# EAGLE design mac-agave (EAGLE 5.11)
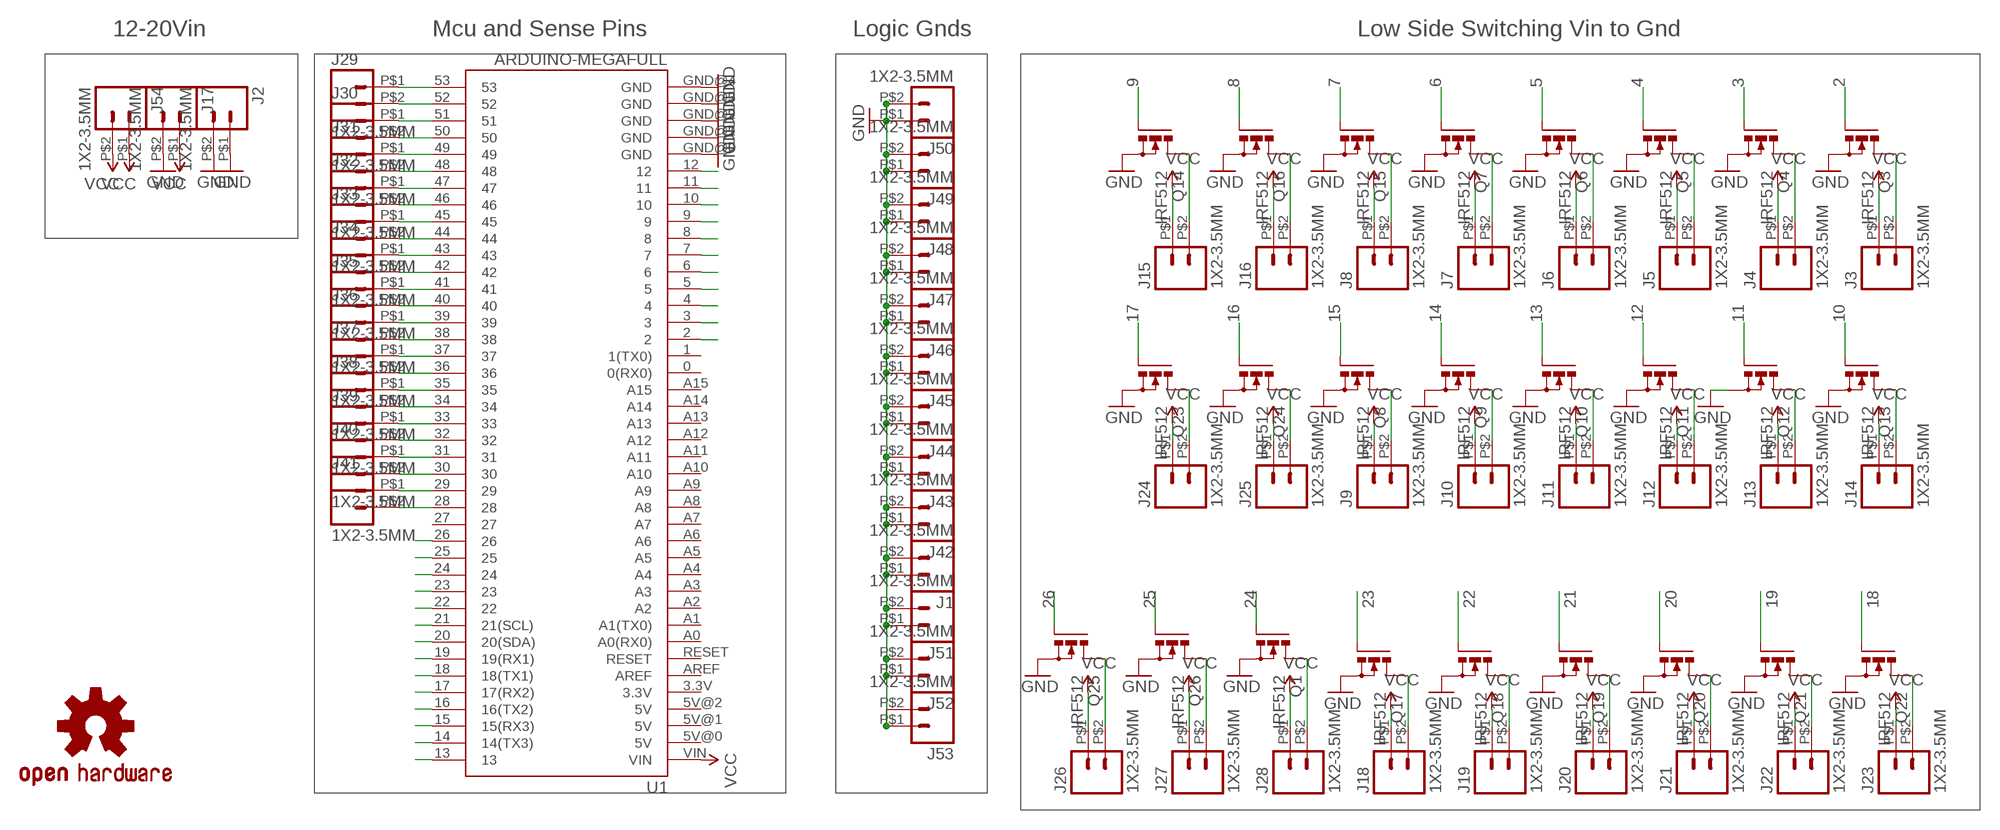
[diagram p0: schematic, sheet 1]

## Parts
J1  1X2-3.5MM  M02  [SCREWTERMINAL-2.54MM-2-NS]
J2  1X2-3.5MM  M02  [SCREWTERMINAL-2.54MM-2-NS]
J3  1X2-3.5MM  M02  [SCREWTERMINAL-2.54MM-2-NS]
J4  1X2-3.5MM  M02  [SCREWTERMINAL-2.54MM-2-NS]
J5  1X2-3.5MM  M02  [SCREWTERMINAL-2.54MM-2-NS]
J6  1X2-3.5MM  M02  [SCREWTERMINAL-2.54MM-2-NS]
J7  1X2-3.5MM  M02  [SCREWTERMINAL-2.54MM-2-NS]
J8  1X2-3.5MM  M02  [SCREWTERMINAL-2.54MM-2-NS]
J9  1X2-3.5MM  M02  [SCREWTERMINAL-2.54MM-2-NS]
J10  1X2-3.5MM  M02  [SCREWTERMINAL-2.54MM-2-NS]
J11  1X2-3.5MM  M02  [SCREWTERMINAL-2.54MM-2-NS]
J12  1X2-3.5MM  M02  [SCREWTERMINAL-2.54MM-2-NS]
J13  1X2-3.5MM  M02  [SCREWTERMINAL-2.54MM-2-NS]
J14  1X2-3.5MM  M02  [SCREWTERMINAL-2.54MM-2-NS]
J15  1X2-3.5MM  M02  [SCREWTERMINAL-2.54MM-2-NS]
J16  1X2-3.5MM  M02  [SCREWTERMINAL-2.54MM-2-NS]
J17  1X2-3.5MM  M02  [SCREWTERMINAL-2.54MM-2-NS]
J18  1X2-3.5MM  M02  [SCREWTERMINAL-2.54MM-2-NS]
J19  1X2-3.5MM  M02  [SCREWTERMINAL-2.54MM-2-NS]
J20  1X2-3.5MM  M02  [SCREWTERMINAL-2.54MM-2-NS]
J21  1X2-3.5MM  M02  [SCREWTERMINAL-2.54MM-2-NS]
J22  1X2-3.5MM  M02  [SCREWTERMINAL-2.54MM-2-NS]
J23  1X2-3.5MM  M02  [SCREWTERMINAL-2.54MM-2-NS]
J24  1X2-3.5MM  M02  [SCREWTERMINAL-2.54MM-2-NS]
J25  1X2-3.5MM  M02  [SCREWTERMINAL-2.54MM-2-NS]
J26  1X2-3.5MM  M02  [SCREWTERMINAL-2.54MM-2-NS]
J27  1X2-3.5MM  M02  [SCREWTERMINAL-2.54MM-2-NS]
J28  1X2-3.5MM  M02  [SCREWTERMINAL-2.54MM-2-NS]
J29  1X2-3.5MM  M02  [SCREWTERMINAL-2.54MM-2-NS]
J30  1X2-3.5MM  M02  [SCREWTERMINAL-2.54MM-2-NS]
J31  1X2-3.5MM  M02  [SCREWTERMINAL-2.54MM-2-NS]
J32  1X2-3.5MM  M02  [SCREWTERMINAL-2.54MM-2-NS]
J33  1X2-3.5MM  M02  [SCREWTERMINAL-2.54MM-2-NS]
J34  1X2-3.5MM  M02  [SCREWTERMINAL-2.54MM-2-NS]
J35  1X2-3.5MM  M02  [SCREWTERMINAL-2.54MM-2-NS]
J36  1X2-3.5MM  M02  [SCREWTERMINAL-2.54MM-2-NS]
J37  1X2-3.5MM  M02  [SCREWTERMINAL-2.54MM-2-NS]
J38  1X2-3.5MM  M02  [SCREWTERMINAL-2.54MM-2-NS]
J39  1X2-3.5MM  M02  [SCREWTERMINAL-2.54MM-2-NS]
J40  1X2-3.5MM  M02  [SCREWTERMINAL-2.54MM-2-NS]
J41  1X2-3.5MM  M02  [SCREWTERMINAL-2.54MM-2-NS]
J42  1X2-3.5MM  M02  [SCREWTERMINAL-2.54MM-2-NS]
J43  1X2-3.5MM  M02  [SCREWTERMINAL-2.54MM-2-NS]
J44  1X2-3.5MM  M02  [SCREWTERMINAL-2.54MM-2-NS]
J45  1X2-3.5MM  M02  [SCREWTERMINAL-2.54MM-2-NS]
J46  1X2-3.5MM  M02  [SCREWTERMINAL-2.54MM-2-NS]
J47  1X2-3.5MM  M02  [SCREWTERMINAL-2.54MM-2-NS]
J48  1X2-3.5MM  M02  [SCREWTERMINAL-2.54MM-2-NS]
J49  1X2-3.5MM  M02  [SCREWTERMINAL-2.54MM-2-NS]
J50  1X2-3.5MM  M02  [SCREWTERMINAL-2.54MM-2-NS]
J51  1X2-3.5MM  M02  [SCREWTERMINAL-2.54MM-2-NS]
J52  1X2-3.5MM  M02  [SCREWTERMINAL-2.54MM-2-NS]
J53  1X2-3.5MM  M02  [SCREWTERMINAL-2.54MM-2-NS]
J54  1X2-3.5MM  M02  [SCREWTERMINAL-2.54MM-2-NS]
Q1  IRF512  [TO220BV]
Q3  IRF512  [TO220BV]
Q4  IRF512  [TO220BV]
Q5  IRF512  [TO220BV]
Q6  IRF512  [TO220BV]
Q7  IRF512  [TO220BV]
Q8  IRF512  [TO220BV]
Q9  IRF512  [TO220BV]
Q10  IRF512  [TO220BV]
Q11  IRF512  [TO220BV]
Q12  IRF512  [TO220BV]
Q13  IRF512  [TO220BV]
Q14  IRF512  [TO220BV]
Q15  IRF512  [TO220BV]
Q16  IRF512  [TO220BV]
Q17  IRF512  [TO220BV]
Q18  IRF512  [TO220BV]
Q19  IRF512  [TO220BV]
Q20  IRF512  [TO220BV]
Q21  IRF512  [TO220BV]
Q22  IRF512  [TO220BV]
Q23  IRF512  [TO220BV]
Q24  IRF512  [TO220BV]
Q25  IRF512  [TO220BV]
Q26  IRF512  [TO220BV]
U1  ARDUINO-MEGAFULL  [ARDUINO_MEGA]
U$1  OSHW-LOGOM  [OSHW-LOGO-M]

## Nets
2: Q3.G U1.2
3: Q4.G U1.3
4: Q5.G U1.4
5: Q6.G U1.5
6: Q7.G U1.6
7: Q15.G U1.7
8: Q16.G U1.8
9: Q14.G U1.9
10: Q13.G U1.10
11: Q12.G U1.11
12: Q11.G U1.12
13: Q10.G U1.13
14: Q9.G U1.14(14(TX3))
15: Q8.G U1.15(15(RX3))
16: Q24.G U1.16(16(TX2))
17: Q23.G U1.17(17(RX2))
18: Q22.G U1.18(18(TX1))
19: Q21.G U1.19(19(RX1))
20: Q20.G U1.20(20(SDA))
21: Q19.G U1.21(21(SCL))
22: Q18.G U1.22
23: Q17.G U1.23
24: Q1.G U1.24
25: Q26.G U1.25
26: Q25.G U1.26
28: J41.P$2 U1.28
29: J41.P$1 U1.29
30: J40.P$2 U1.30
31: J40.P$1 U1.31
32: J39.P$2 U1.32
33: J39.P$1 U1.33
34: J38.P$2 U1.34
35: J38.P$1 U1.35
36: J37.P$2 U1.36
37: J37.P$1 U1.37
38: J36.P$2 U1.38
39: J36.P$1 U1.39
40: J35.P$2 U1.40
41: J35.P$1 U1.41
42: J34.P$2 U1.42
43: J34.P$1 U1.43
44: J33.P$2 U1.44
45: J33.P$1 U1.45
46: J32.P$2 U1.46
47: J32.P$1 U1.47
48: J31.P$2 U1.48
49: J31.P$1 U1.49
50: J30.P$2 U1.50
51: J30.P$1 U1.51
52: J29.P$2 U1.52
53: J29.P$1 U1.53
GND: J1.P$1 J1.P$2 J2.P$1 J2.P$2 J17.P$2 J42.P$1 J42.P$2 J43.P$1 J43.P$2 J44.P$1 J44.P$2 J45.P$1 J45.P$2 J46.P$1 J46.P$2 J47.P$1 J47.P$2 J48.P$1 J48.P$2 J49.P$1 J49.P$2 J50.P$1 J50.P$2 J51.P$1 J51.P$2 J52.P$1 J52.P$2 J53.P$1 J53.P$2 Q1.S Q3.S Q4.S Q5.S Q6.S Q7.S Q8.S Q9.S Q10.S Q11.S Q12.S Q13.S Q14.S Q15.S Q16.S Q17.S Q18.S Q19.S Q20.S Q21.S Q22.S Q23.S Q24.S Q25.S Q26.S U1.GND@0(GND) U1.GND@1(GND) U1.GND@2(GND) U1.GND@3(GND) U1.GND@4(GND)
N$1 [power]: J9.P$2 Q8.D
N$2 [power]: J10.P$2 Q9.D
N$4 [power]: J11.P$2 Q10.D
N$5 [power]: J3.P$2 Q3.D
N$6 [power]: J18.P$2 Q17.D
N$7 [power]: J4.P$2 Q4.D
N$8 [power]: J19.P$2 Q18.D
N$9 [power]: J5.P$2 Q5.D
N$10 [power]: J12.P$2 Q11.D
N$11 [power]: J13.P$2 Q12.D
N$12 [power]: J14.P$2 Q13.D
N$13 [power]: J15.P$2 Q14.D
N$14 [power]: J16.P$2 Q16.D
N$21 [power]: J6.P$2 Q6.D
N$23 [power]: J7.P$2 Q7.D
N$25 [power]: J8.P$2 Q15.D
N$35 [power]: J20.P$2 Q19.D
N$36 [power]: J21.P$2 Q20.D
N$37 [power]: J22.P$2 Q21.D
N$38 [power]: J23.P$2 Q22.D
N$39 [power]: J24.P$2 Q23.D
N$40 [power]: J25.P$2 Q24.D
N$49 [power]: J26.P$2 Q25.D
N$50 [power]: J27.P$2 Q26.D
N$51 [power]: J28.P$2 Q1.D
VCC [power]: J3.P$1 J4.P$1 J5.P$1 J6.P$1 J7.P$1 J8.P$1 J9.P$1 J10.P$1 J11.P$1 J12.P$1 J13.P$1 J14.P$1 J15.P$1 J16.P$1 J17.P$1 J18.P$1 J19.P$1 J20.P$1 J21.P$1 J22.P$1 J23.P$1 J24.P$1 J25.P$1 J26.P$1 J27.P$1 J28.P$1 J54.P$1 J54.P$2 U1.VIN
Unconnected: U1.0(0(RX0)) U1.1(1(TX0)) U1.3.3V U1.5V@0(5V) U1.5V@1(5V) U1.5V@2(5V) U1.27 U1.A0(A0(RX0)) U1.A1(A1(TX0)) U1.A2 U1.A3 U1.A4 U1.A5 U1.A6 U1.A7 U1.A8 U1.A9 U1.A10 U1.A11 U1.A12 U1.A13 U1.A14 U1.A15 U1.AREF U1.RESET

## Notes on the sheet
- 12-20Vin | Mcu and Sense Pins | Logic Gnds | Low Side Switching Vin to Gnd

## Library data of the parts
J1-J54 = SparkFun:M02: Header 2 Standard 2-pin 0.1" header. Use with straight break away headers (SKU : PRT-00116), right angle break away headers (PRT-00553), swiss pins (PRT-00743), machine pins (PRT-00117), and female headers (PRT-00115). Molex polarized connector foot print use with SKU : PRT-08233 with associated crimp pins and housings.
Q1 Q3-Q26 = transistor-power:IRF512: N-CHANNEL MOS FET
U1 = SparkFun:ARDUINO-MEGA: Arduino Mega footprint connections
U$1 = SparkFun:OSHW-LOGO: Open Source Hardware Logo This logo indicates the piece of hardware it is found on incorporates a OSHW license and/or adheres to the definition of open source hardware found here: http://freedomdefined.org/OSHW

## Net classes
1 power: width 1.905 mm

## Board
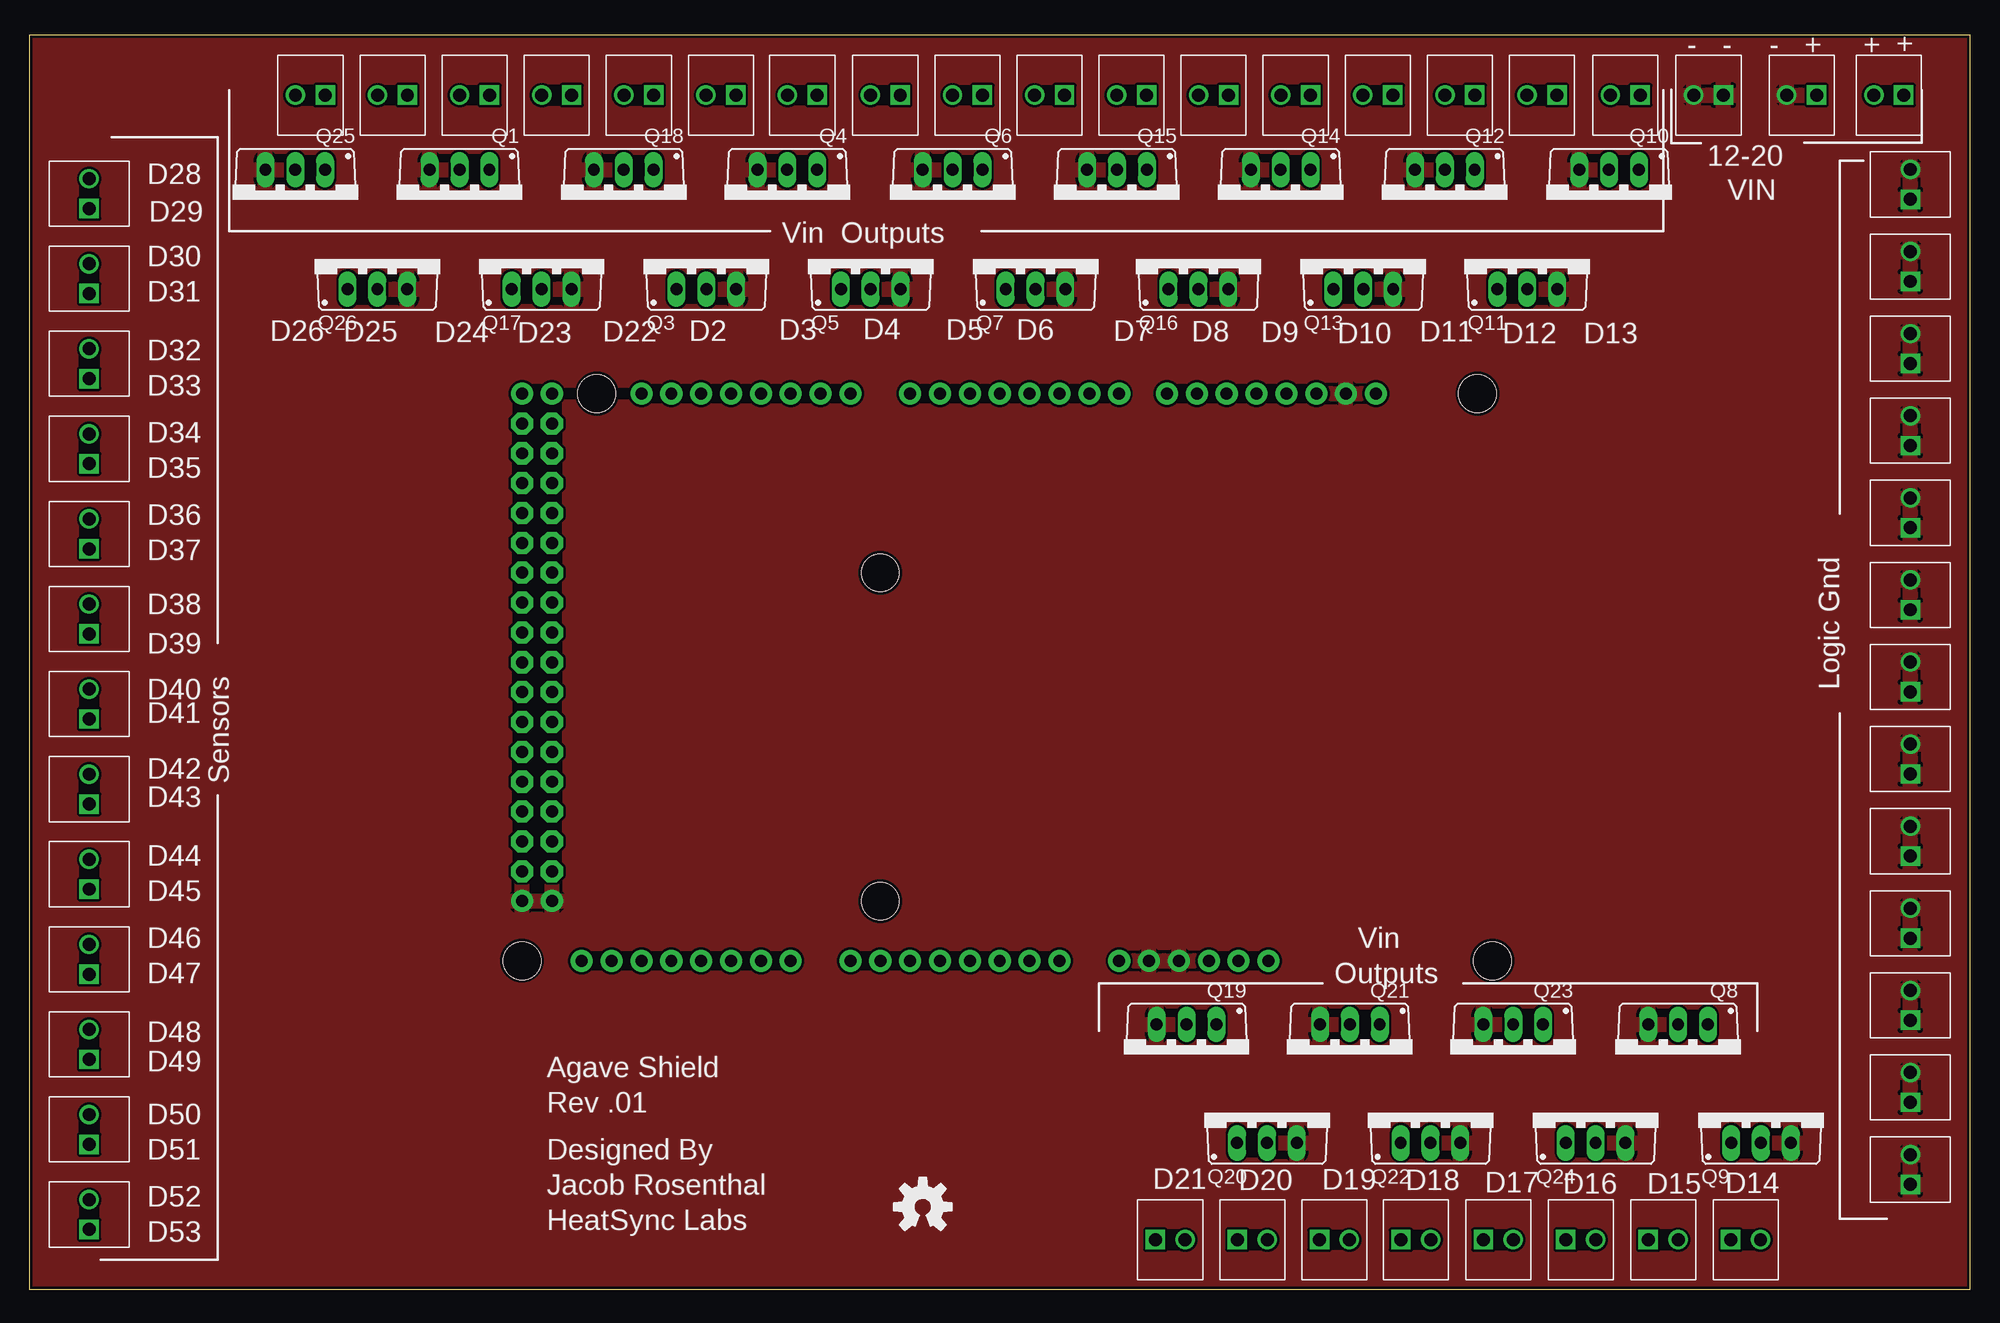
[diagram p1: board, top side]
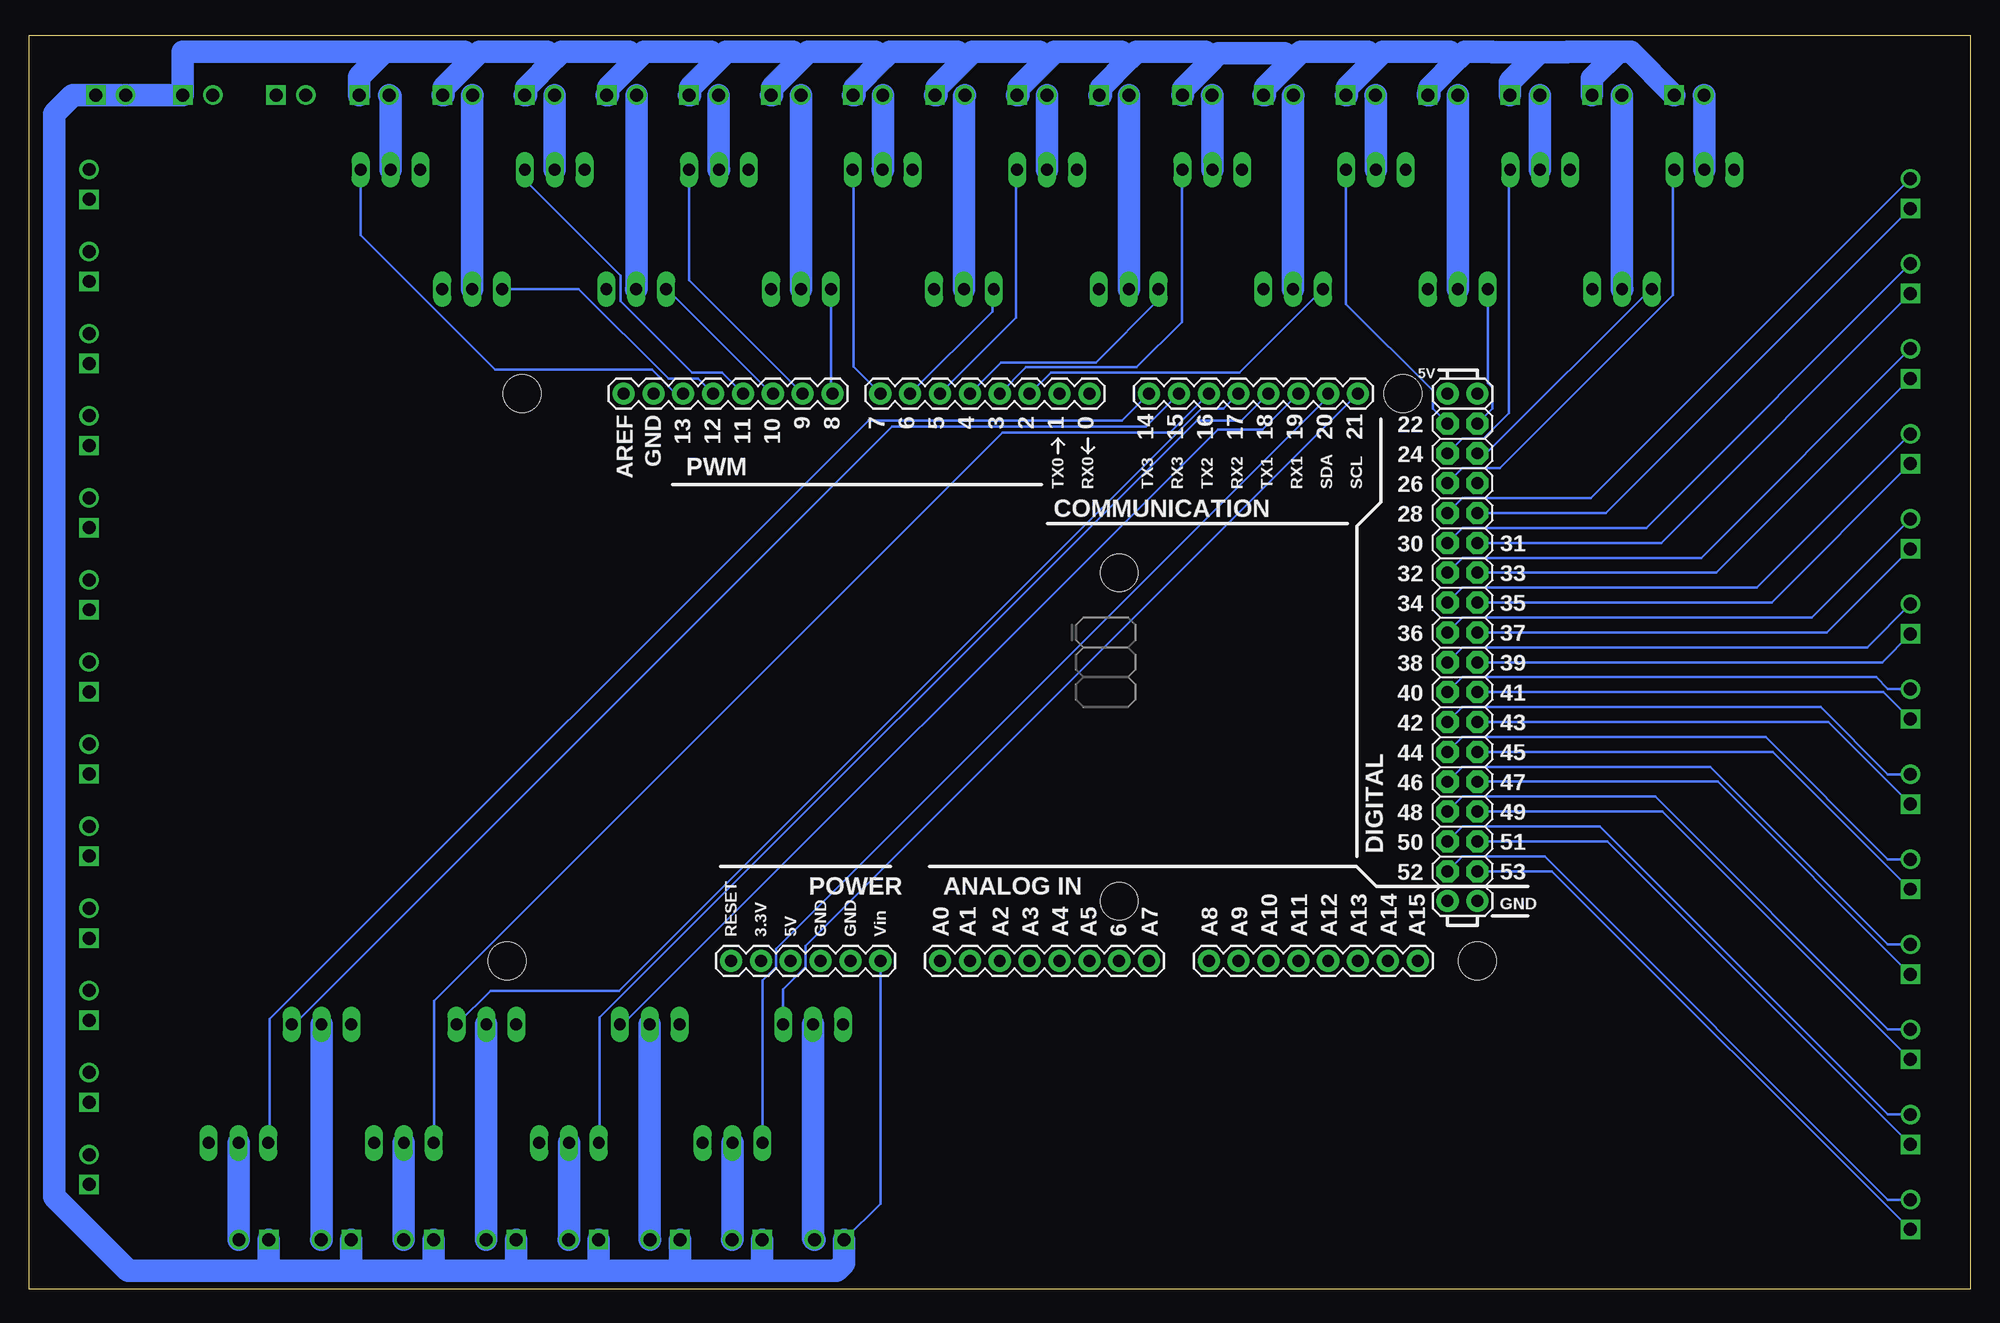
[diagram p2: board, bottom side, seen from below]

Size 165.1 x 106.68 mm. Coordinates in mm from the lower left corner, seen from the top.
Outline: 0,0 165.1,0 165.1,106.68 0,106.68 0,0
Copper layers (1*16): Top 0.035mm / dielectric 1.5mm / Bottom 0.035mm
Design rules "Fusion_eagle_rule_v1.1 *": minimum track width 8mil, minimum drill 12mil, track to track 8mil, track to pad 8mil, pad to pad 8mil, via to via 8mil, smd to smd 0mil, copper to edge 10mil, drill to drill 10mil, minimum pad ring 10mil, minimum via ring 6mil, stop-mask expansion 2mil, vias tented up to drill 100mil, thermal gap 10mil

### Footprints (pad centres in the part's own frame; a part is rotated, then mirrored left to right if it is on the bottom)
SCREWTERMINAL-2.54MM-2-NS = drill 1.1 square: P$1 0,0 | drill 1.1 round: P$2 2.54,0
TO220BV = drill 1.016 long: D 0,-2.54; G -2.54,-2.54; S 2.54,-2.54
ARDUINO_MEGA = drill 1.016 pad 1.88 round: 0 63.5,50.8; 1 60.96,50.8; 2 58.42,50.8; 3 55.88,50.8; 3.3V 35.56,2.54; 4 53.34,50.8; 5 50.8,50.8; 5V@0 38.1,2.54; 5V@1 93.98,50.8; 5V@2 96.52,50.8; 6 48.26,50.8; 7 45.72,50.8; 8 41.656,50.8; 9 39.116,50.8; 10 36.576,50.8; 11 34.036,50.8; 12 31.496,50.8; 13 28.956,50.8; 14 68.58,50.8; 15 71.12,50.8; 16 73.66,50.8; 17 76.2,50.8; 18 78.74,50.8; 19 81.28,50.8; 20 83.82,50.8; 21 86.36,50.8; A0 50.8,2.54; A1 53.34,2.54; A2 55.88,2.54; A3 58.42,2.54; A4 60.96,2.54; A5 63.5,2.54; A6 66.04,2.54; A7 68.58,2.54; A8 73.66,2.54; A9 76.2,2.54; A10 78.74,2.54; A11 81.28,2.54; A12 83.82,2.54; A13 86.36,2.54; A14 88.9,2.54; A15 91.44,2.54; AREF 23.876,50.8; GND@0 40.64,2.54; GND@1 43.18,2.54; GND@2 93.98,7.62; GND@3 96.52,7.62; GND@4 26.416,50.8; RESET 33.02,2.54; VIN 45.72,2.54 | drill 1.016 pad 1.88 octagon: 22 93.98,48.26; 23 96.52,48.26; 24 93.98,45.72; 25 96.52,45.72; 26 93.98,43.18; 27 96.52,43.18; 28 93.98,40.64; 29 96.52,40.64; 30 93.98,38.1; 31 96.52,38.1; 32 93.98,35.56; 33 96.52,35.56; 34 93.98,33.02; 35 96.52,33.02; 36 93.98,30.48; 37 96.52,30.48; 38 93.98,27.94; 39 96.52,27.94; 40 93.98,25.4; 41 96.52,25.4; 42 93.98,22.86; 43 96.52,22.86; 44 93.98,20.32; 45 96.52,20.32; 46 93.98,17.78; 47 96.52,17.78; 48 93.98,15.24; 49 96.52,15.24; 50 93.98,12.7; 51 96.52,12.7; 52 93.98,10.16; 53 96.52,10.16 | hole 3.2: 15.24,50.8; 13.97,2.54; 66.04,35.56; 66.04,7.62; 90.17,50.8; 96.52,2.54

### Placement (x,y rotation side)
J1  160.02,15.89 90 top
J2  144.12,101.6 180 top
J3  60.1,101.6 180 top
J4  67.02,101.6 180 top
J5  74.08,101.6 180 top
J6  81.07,101.6 180 top
J7  88.06,101.6 180 top
J8  95.04,101.6 180 top
J9  137.72,4.21 0 top
J10  144.74,4.21 0 top
J11  137.03,101.6 180 top
J12  129.95,101.6 180 top
J13  122.97,101.6 180 top
J14  115.98,101.6 180 top
J15  109,101.6 180 top
J16  102.01,101.6 180 top
J17  152.04,101.6 180 top
J18  46.13,101.6 180 top
J19  53.12,101.6 180 top
J20  95.78,4.21 0 top
J21  102.77,4.21 0 top
J22  109.75,4.21 0 top
J23  116.68,4.21 0 top
J24  123.69,4.21 0 top
J25  130.71,4.21 0 top
J26  25.18,101.6 180 top
J27  32.16,101.6 180 top
J28  39.15,101.6 180 top
J29  5.08,5.08 90 top
J30  5.08,12.32 90 top
J31  5.08,19.56 90 top
J32  5.08,26.8 90 top
J33  5.08,34.04 90 top
J34  5.08,41.27 90 top
J35  5.08,48.51 90 top
J36  5.08,55.75 90 top
J37  5.08,62.99 90 top
J38  5.08,70.23 90 top
J39  5.08,77.47 90 top
J40  5.08,84.71 90 top
J41  5.08,91.95 90 top
J42  160.02,36.85 90 top
J43  160.02,8.91 90 top
J44  160.02,22.88 90 top
J45  160.02,29.86 90 top
J46  160.02,43.84 90 top
J47  160.02,50.82 90 top
J48  160.02,57.8 90 top
J49  160.02,64.79 90 top
J50  160.02,71.78 90 top
J51  160.02,78.76 90 top
J52  160.02,85.75 90 top
J53  160.02,92.73 90 top
J54  159.45,101.6 180 top
Q1  36.59,92.71 180 top
Q3  57.59,87.63 0 top
Q4  64.47,92.71 180 top
Q5  71.57,87.63 0 top
Q6  78.54,92.71 180 top
Q7  85.6,87.63 0 top
Q8  140.26,19.99 180 top
Q9  147.31,14.99 0 top
Q10  134.38,92.71 180 top
Q11  127.43,87.63 0 top
Q12  120.41,92.71 180 top
Q13  113.47,87.63 0 top
Q14  106.44,92.71 180 top
Q15  92.52,92.71 180 top
Q16  99.45,87.63 0 top
Q17  43.58,87.63 0 top
Q18  50.56,92.71 180 top
Q19  98.44,19.99 180 top
Q20  105.28,14.99 0 top
Q21  112.33,19.99 180 top
Q22  119.2,14.99 0 top
Q23  126.23,19.99 180 top
Q24  133.24,14.99 0 top
Q25  22.62,92.71 180 top
Q26  29.61,87.63 0 top
U1  138.43,25.4 0 bottom
U$1  76,7 0 top

### Tracks (layer width: path | path; a pad name or v marks a point on that pad's centre or on a via)
2
  Bottom 0.203: Q3.G 62.15,78 78.21,78 U1.2
3
  Bottom 0.203: Q4.G 67.06,95.25 67.06,82.3 70.92,78.44 80.31,78.44 U1.3
4
  Bottom 0.203: Q5.G 69.03,84.18 74.37,78.84 82.45,78.84 U1.4
5
  Bottom 0.203: U1.5 81.15,82.68 81.15,95.25 Q6.G
6
  Bottom 0.203: U1.6 83.19,83.19 83.19,85.09 Q7.G
7
  Bottom 0.203: U1.7 95,78.49 95,95.25 Q15.G
8
  Bottom 0.203: U1.8 96.9,76.33 Q16.G
9
  Bottom 0.203: U1.9 108.97,85.85 108.97,95.25 Q14.G
10
  Top 0.203: U1.10 101.98,76.2 | Q13.G 110.87,85.09
  Bottom 0.203: U1.10 101.98,76.2 110.87,85.09 Q13.G
11
  Bottom 0.203: U1.11 106.17,77.98 108.71,77.98 114.81,84.07 114.81,86.23 122.94,94.36 122.94,95.25 Q12.G
12
  Bottom 0.203: U1.12 108.2,77.47 110.74,77.47 118.36,85.09 Q11.G
13
  Bottom 0.203: U1.13 110.11,76.2 112.14,78.23 125.48,78.23 136.91,89.66 136.91,95.25 Q10.G
14
  Bottom 0.203: U1.14 72.14,73.91 93.73,73.91 144.65,22.99 144.65,12.45 Q9.G
15
  Bottom 0.203: Q8.G 142.75,22.61 142.49,22.61 91.69,73.41 70.1,73.41 U1.15
16
  Bottom 0.203: U1.16 68.07,72.9 82.3,72.9 130.68,24.51 130.68,12.45 Q24.G
17
  Bottom 0.203: U1.17 63.5,74.93 65.41,74.93 114.94,25.4 125.86,25.4 128.65,22.61 Q23.G
18
  Bottom 0.203: U1.18 61.98,73.91 65.79,73.91 116.59,23.11 116.59,12.45 Q22.G
19
  Bottom 0.203: U1.19 60.2,73.15 64.01,73.15 114.55,22.61 114.81,22.61 Q21.G
20
  Bottom 0.203: U1.20 54.61,75.95 101.6,28.96 101.6,27.43 102.74,26.29 Q20.G
21
  Bottom 0.203: U1.21 99.06,29.21 99.06,27.43 100.97,25.53 100.97,22.61 Q19.G
22
  Bottom 0.203: U1.22 45.72,74.93 45.72,76.45 53.09,83.82 53.09,95.25 Q18.G
23
  Bottom 0.203: U1.23 40.64,74.93 40.64,76.71 41.02,77.09 41.02,85.09 Q17.G
24
  Bottom 0.203: U1.24 43.18,72.39 41.4,72.39 39.24,74.55 39.24,95.25 Q1.G
25
  Bottom 0.203: U1.25 41.15,71.12 27.18,85.09 Q26.G
26
  Bottom 0.203: U1.26 43.18,69.85 40.01,69.85 25.27,84.58 25.27,95.25 Q25.G
28
  Bottom 0.203: U1.28 43.18,67.31 32.26,67.31 J41.P$2
29
  Bottom 0.203: U1.29 30.99,66.04 J41.P$1
30
  Bottom 0.203: U1.30 43.18,64.77 27.56,64.77 J40.P$2
31
  Bottom 0.203: U1.31 26.29,63.5 J40.P$1
32
  Bottom 0.203: U1.32 43.18,62.23 22.86,62.23 J39.P$2
33
  Bottom 0.203: U1.33 21.59,60.96 J39.P$1
34
  Bottom 0.203: U1.34 43.18,59.69 18.16,59.69 J38.P$2
35
  Bottom 0.203: U1.35 16.89,58.42 J38.P$1
36
  Bottom 0.203: U1.36 43.18,57.15 13.46,57.15 J37.P$2
37
  Bottom 0.203: U1.37 12.19,55.88 J37.P$1
38
  Bottom 0.203: U1.38 43.18,54.61 8.76,54.61 J36.P$2
39
  Bottom 0.203: U1.39 7.49,53.34 J36.P$1
40
  Bottom 0.203: J35.P$2 6.99,51.05 8,52.07 43.18,52.07 U1.40
41
  Bottom 0.203: U1.41 7.37,50.8 J35.P$1
42
  Bottom 0.203: J34.P$2 6.99,43.81 12.7,49.53 43.18,49.53 U1.42
43
  Bottom 0.203: U1.43 12.06,48.26 J34.P$1
44
  Bottom 0.203: J33.P$2 6.99,36.58 17.4,46.99 43.18,46.99 U1.44
45
  Bottom 0.203: U1.45 16.76,45.72 J33.P$1
46
  Bottom 0.203: J32.P$2 6.99,29.34 22.1,44.45 43.18,44.45 U1.46
47
  Bottom 0.203: U1.47 21.46,43.18 J32.P$1
48
  Bottom 0.203: J31.P$2 6.99,22.1 26.8,41.91 43.18,41.91 U1.48
49
  Bottom 0.203: U1.49 26.16,40.64 J31.P$1
50
  Bottom 0.203: J30.P$2 6.99,14.86 31.5,39.37 43.18,39.37 U1.50
51
  Bottom 0.203: U1.51 30.86,38.1 J30.P$1
52
  Bottom 0.203: J29.P$2 6.99,7.62 36.2,36.83 43.18,36.83 U1.52
53
  Bottom 0.203: U1.53 35.56,35.56 J29.P$1
GND
  pour Top: 0,106.41 165.1,106.68 165.1,0 0,0
  pour Top: 165.15,106.65 165.15,0.05 165.05,106.65
N$1
  Bottom 1.905: Q8.D J9.P$2
N$2
  Bottom 1.905: Q9.D 147.31,4.25 J10.P$2
N$4
  Bottom 1.905: Q10.D 134.38,101.48 J11.P$2
N$5
  Bottom 1.905: J3.P$2 57.59,101.56 Q3.D
N$6
  Bottom 1.905: J18.P$2 43.59,85.11 Q17.D
N$7
  Bottom 1.905: Q4.D 64.47,101.58 J4.P$2
N$8
  Bottom 1.905: J19.P$2 50.56,101.58 Q18.D
N$9
  Bottom 1.905: J5.P$2 71.55,85.11 Q5.D
N$10
  Bottom 1.905: J12.P$2 127.43,101.58 Q11.D
N$11
  Bottom 1.905: J13.P$2 120.41,101.58 Q12.D
N$12
  Bottom 1.905: J14.P$2 113.44,85.12 Q13.D
N$13
  Bottom 1.905: J15.P$2 106.45,95.27 Q14.D
N$14
  Bottom 1.905: J16.P$2 99.47,85.11 Q16.D
N$21
  Bottom 1.905: J6.P$2 Q6.D
N$23
  Bottom 1.905: J7.P$2 85.6,101.52 Q7.D
N$25
  Bottom 1.905: J8.P$2 92.5,95.27 Q15.D
N$35
  Bottom 1.905: Q19.D 98.44,4.33 J20.P$2
N$36
  Bottom 1.905: Q20.D 105.28,4.23 J21.P$2
N$37
  Bottom 1.905: Q21.D 112.33,4.25 J22.P$2
N$38
  Bottom 1.905: Q22.D 119.19,4.23 J23.P$2
N$39
  Bottom 1.905: Q23.D J24.P$2
N$40
  Bottom 1.905: Q24.D J25.P$2
N$49
  Bottom 1.905: J26.P$2 22.62,101.58 Q25.D
N$50
  Bottom 1.905: Q26.D 29.62,85.11 J27.P$2
N$51
  Bottom 1.905: J28.P$2 36.6,95.27 Q1.D
VCC
  Bottom 0.203: J20.P$1 92.71,7.28 U1.VIN
  Bottom 1.905: J26.P$1 28.87,105.28 29.9,105.28 | 32.18,101.6 J27.P$1 32.16,103.02 29.9,105.28 | 46.02,102.23 46.02,101.6 | 43.61,104.65 42.97,105.28 40.68,105.28 40.65,105.25 36.6,105.25 | 43.61,104.65 46.02,102.23 | 50.59,104.65 49.96,105.28 44.24,105.28 43.61,104.65 | 50.59,104.65 53,102.23 53,101.6 J19.P$1 | 57.7,104.52 56.94,105.28 51.23,105.28 50.59,104.65 | 57.7,104.52 59.99,102.23 59.99,101.6 J3.P$1 | 64.43,104.65 63.93,105.16 58.34,105.16 57.7,104.52 | 64.43,104.65 66.97,102.11 66.97,101.6 J4.P$1 | 71.55,104.65 70.91,105.28 65.07,105.28 64.43,104.65 | 71.55,104.65 73.96,102.23 73.96,101.6 J5.P$1 | 78.53,104.65 77.9,105.28 72.18,105.28 71.55,104.65 | 78.53,104.65 80.94,102.23 80.94,101.6 J6.P$1 | 85.52,104.65 84.88,105.28 79.17,105.28 78.53,104.65 | 85.52,104.65 87.93,102.23 87.93,101.6 J7.P$1 | 92.5,104.65 91.87,105.28 86.15,105.28 85.52,104.65 | 92.5,104.65 94.91,102.23 94.91,101.6 J8.P$1 | 99.49,104.65 98.85,105.28 93.14,105.28 92.5,104.65 | 99.49,104.65 101.9,102.23 101.9,101.6 J16.P$1 | 106.47,104.65 105.84,105.28 100.12,105.28 99.49,104.65 | 106.47,104.65 108.88,102.23 108.88,101.6 J15.P$1 | 113.46,104.65 112.82,105.28 107.11,105.28 106.47,104.65 | 113.46,104.65 115.87,102.23 115.87,101.6 J14.P$1 | 120.44,104.65 119.81,105.28 114.09,105.28 113.46,104.65 | 120.44,104.65 122.85,102.23 122.85,101.6 J13.P$1 | 127.43,104.65 126.79,105.28 121.08,105.28 120.44,104.65 | 127.43,104.65 129.84,102.23 129.84,101.6 J12.P$1 | 127.43,104.65 128.06,105.28 134.92,105.28 | 39.16,102.36 39.16,101.6 J28.P$1 39.15,102.75 36.9,105 36.85,105 36.6,105.25 | J18.P$1 46.15,101.6 46.02,102.23 | 36.6,105.25 34.3,105.25 34.27,105.28 29.9,105.28
  Bottom 1.905: 145,1.55 156.7,1.55 163,7.85 163,100 161.4,101.6 J54.P$1 J54.P$2 J17.P$1 152.04,105.28 134.92,105.28 | 145,1.55 138,1.55 | 138,1.55 131,1.55 | 131,1.55 124,1.55 | 124,1.55 117,1.55 | 117,1.55 110,1.55 | 110,1.55 103,1.55 | 103,1.55 96.45,1.55 95.78,2.22 J20.P$1 | J21.P$1 102.77,1.78 103,1.55 | J22.P$1 109.75,1.8 110,1.55 | J23.P$1 116.67,1.88 117,1.55 | J24.P$1 123.69,1.86 124,1.55 | J25.P$1 130.71,1.84 131,1.55 | J9.P$1 137.72,1.83 138,1.55 | J10.P$1 144.74,1.81 145,1.55 | J11.P$1 137.03,103.17 134.92,105.28

### Text on the board
tPlace: - | - | - | + | + | + | 12-20 | D28 | VIN | D29 | Vin | Outputs | D30 | D31 | D26 | D25 | D24 | D22 | D2 | D3 | D4 | D5 | D6 | D7 | D8 | D9 | D11 | D23 | D10 | D12 | D13 | D32 | D33 | D34 | D35 | D36 | D37 | D38 | D39 | Logic Gnd | D40 | D41 | D42 | Sensors | D43 | D44 | D45 | D46 | Vin | D47 | Outputs | D48 | D49 | Agave Shield | Rev .01 | D50 | D51 | Designed By | Jacob Rosenthal | D21 | D20 | D19 | D18 | D17 | D16 | D15 | D14 | D52 | HeatSync Labs | D53